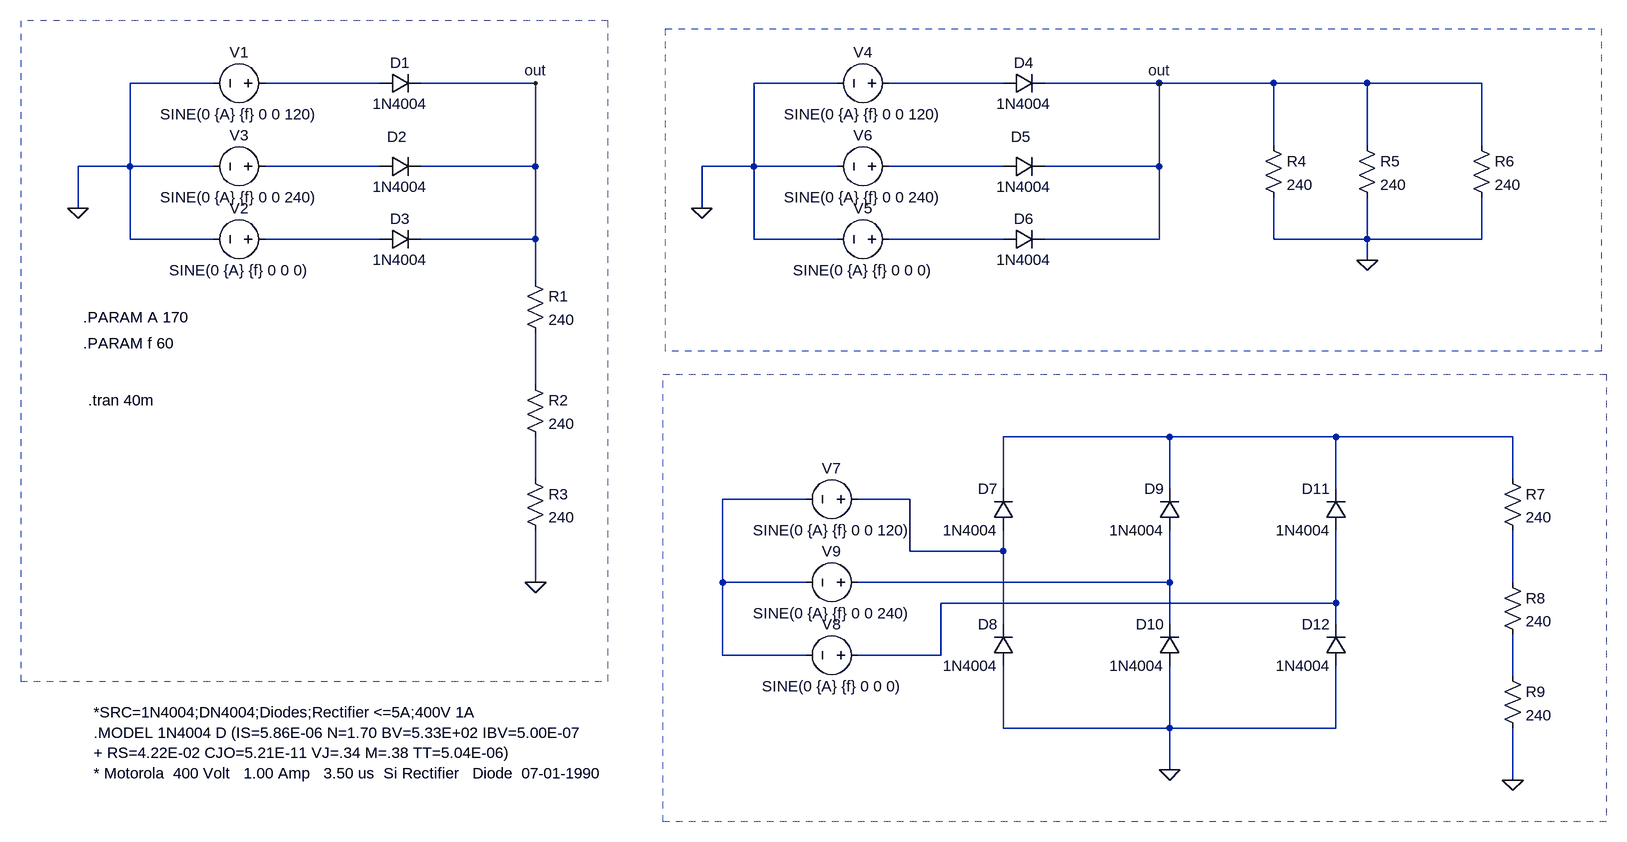
[diagram p0: schematic Draft1.asc]
Draft1.asc, the LTspice schematic file:
Version 4
SHEET 1 1908 1236
WIRE -240 96 -368 96
WIRE 16 96 -160 96
WIRE 256 96 80 96
WIRE 720 96 592 96
WIRE 976 96 800 96
WIRE 1216 96 1040 96
WIRE 1392 96 1216 96
WIRE 1536 96 1392 96
WIRE 1712 96 1536 96
WIRE 1392 192 1392 96
WIRE 1536 192 1536 96
WIRE 1712 192 1712 96
WIRE -368 224 -368 96
WIRE -368 224 -448 224
WIRE -240 224 -368 224
WIRE 16 224 -160 224
WIRE 256 224 256 96
WIRE 256 224 80 224
WIRE 592 224 592 96
WIRE 592 224 512 224
WIRE 720 224 592 224
WIRE 976 224 800 224
WIRE 1216 224 1216 96
WIRE 1216 224 1040 224
WIRE -448 288 -448 224
WIRE 512 288 512 224
WIRE -368 336 -368 224
WIRE -240 336 -368 336
WIRE 16 336 -160 336
WIRE 256 336 256 224
WIRE 256 336 80 336
WIRE 592 336 592 224
WIRE 720 336 592 336
WIRE 976 336 800 336
WIRE 1216 336 1216 224
WIRE 1216 336 1040 336
WIRE 1392 336 1392 272
WIRE 1536 336 1536 272
WIRE 1536 336 1392 336
WIRE 1712 336 1712 272
WIRE 1712 336 1536 336
WIRE 1536 368 1536 336
WIRE 256 400 256 336
WIRE 256 560 256 480
WIRE 1232 640 976 640
WIRE 1488 640 1232 640
WIRE 1760 640 1488 640
WIRE 256 704 256 640
WIRE 1760 704 1760 640
WIRE 976 720 976 640
WIRE 1232 720 1232 640
WIRE 1488 720 1488 640
WIRE 672 736 544 736
WIRE 832 736 752 736
WIRE 832 816 832 736
WIRE 976 816 976 784
WIRE 976 816 832 816
WIRE 256 864 256 784
WIRE 544 864 544 736
WIRE 672 864 544 864
WIRE 1232 864 1232 784
WIRE 1232 864 752 864
WIRE 1760 864 1760 784
WIRE 1488 896 1488 784
WIRE 1488 896 880 896
WIRE 976 928 976 816
WIRE 1232 928 1232 864
WIRE 1488 928 1488 896
WIRE 544 976 544 864
WIRE 672 976 544 976
WIRE 880 976 880 896
WIRE 880 976 752 976
WIRE 1760 1008 1760 944
WIRE 976 1088 976 992
WIRE 1232 1088 1232 992
WIRE 1232 1088 976 1088
WIRE 1488 1088 1488 992
WIRE 1488 1088 1232 1088
WIRE 1232 1152 1232 1088
WIRE 1760 1168 1760 1088
FLAG -448 288 0
FLAG 256 864 0
FLAG 256 96 out
FLAG 512 288 0
FLAG 1216 96 out
FLAG 1536 368 0
FLAG 1760 1168 0
FLAG 1232 1152 0
SYMBOL diode 16 112 R270
WINDOW 0 32 32 VTop 2
WINDOW 3 0 32 VBottom 2
SYMATTR InstName D1
SYMATTR Value 1N4004
SYMBOL diode 16 240 R270
WINDOW 0 46 27 VTop 2
WINDOW 3 0 32 VBottom 2
SYMATTR InstName D2
SYMATTR Value 1N4004
SYMBOL diode 16 352 R270
WINDOW 0 32 32 VTop 2
WINDOW 3 0 32 VBottom 2
SYMATTR InstName D3
SYMATTR Value 1N4004
SYMBOL Voltage -144 96 R90
WINDOW 0 -32 56 VBottom 2
WINDOW 3 32 56 VTop 2
SYMATTR InstName V1
SYMATTR Value SINE(0 {A} {f} 0 0 120)
SYMBOL Voltage -144 336 R90
WINDOW 0 -32 56 VBottom 2
WINDOW 3 32 56 VTop 2
SYMATTR InstName V2
SYMATTR Value SINE(0 {A} {f} 0 0 0)
SYMBOL Voltage -144 224 R90
WINDOW 0 -32 56 VBottom 2
WINDOW 3 32 56 VTop 2
SYMATTR InstName V3
SYMATTR Value SINE(0 {A} {f} 0 0 240)
SYMBOL Res 240 384 R0
SYMATTR InstName R1
SYMATTR Value 240
SYMBOL Res 240 544 R0
SYMATTR InstName R2
SYMATTR Value 240
SYMBOL Res 240 688 R0
SYMATTR InstName R3
SYMATTR Value 240
SYMBOL diode 976 112 R270
WINDOW 0 32 32 VTop 2
WINDOW 3 0 32 VBottom 2
SYMATTR InstName D4
SYMATTR Value 1N4004
SYMBOL diode 976 240 R270
WINDOW 0 46 27 VTop 2
WINDOW 3 0 32 VBottom 2
SYMATTR InstName D5
SYMATTR Value 1N4004
SYMBOL diode 976 352 R270
WINDOW 0 32 32 VTop 2
WINDOW 3 0 32 VBottom 2
SYMATTR InstName D6
SYMATTR Value 1N4004
SYMBOL Voltage 816 96 R90
WINDOW 0 -32 56 VBottom 2
WINDOW 3 32 56 VTop 2
SYMATTR InstName V4
SYMATTR Value SINE(0 {A} {f} 0 0 120)
SYMBOL Voltage 816 336 R90
WINDOW 0 -32 56 VBottom 2
WINDOW 3 32 56 VTop 2
SYMATTR InstName V5
SYMATTR Value SINE(0 {A} {f} 0 0 0)
SYMBOL Voltage 816 224 R90
WINDOW 0 -32 56 VBottom 2
WINDOW 3 32 56 VTop 2
SYMATTR InstName V6
SYMATTR Value SINE(0 {A} {f} 0 0 240)
SYMBOL Res 1376 176 R0
SYMATTR InstName R4
SYMATTR Value 240
SYMBOL Res 1520 176 R0
SYMATTR InstName R5
SYMATTR Value 240
SYMBOL Res 1696 176 R0
SYMATTR InstName R6
SYMATTR Value 240
SYMBOL Diode 992 784 R180
WINDOW 0 24 64 Left 2
WINDOW 3 24 0 Left 2
SYMATTR InstName D7
SYMATTR Value 1N4004
SYMBOL Diode 992 992 R180
WINDOW 0 24 64 Left 2
WINDOW 3 24 0 Left 2
SYMATTR InstName D8
SYMATTR Value 1N4004
SYMBOL Diode 1248 784 R180
WINDOW 0 24 64 Left 2
WINDOW 3 24 0 Left 2
SYMATTR InstName D9
SYMATTR Value 1N4004
SYMBOL Diode 1248 992 R180
WINDOW 0 24 64 Left 2
WINDOW 3 24 0 Left 2
SYMATTR InstName D10
SYMATTR Value 1N4004
SYMBOL Diode 1504 784 R180
WINDOW 0 24 64 Left 2
WINDOW 3 24 0 Left 2
SYMATTR InstName D11
SYMATTR Value 1N4004
SYMBOL Diode 1504 992 R180
WINDOW 0 24 64 Left 2
WINDOW 3 24 0 Left 2
SYMATTR InstName D12
SYMATTR Value 1N4004
SYMBOL Voltage 768 736 R90
WINDOW 0 -32 56 VBottom 2
WINDOW 3 32 56 VTop 2
SYMATTR InstName V7
SYMATTR Value SINE(0 {A} {f} 0 0 120)
SYMBOL Voltage 768 976 R90
WINDOW 0 -32 56 VBottom 2
WINDOW 3 32 56 VTop 2
SYMATTR InstName V8
SYMATTR Value SINE(0 {A} {f} 0 0 0)
SYMBOL Voltage 768 864 R90
WINDOW 0 -32 56 VBottom 2
WINDOW 3 32 56 VTop 2
SYMATTR InstName V9
SYMATTR Value SINE(0 {A} {f} 0 0 240)
SYMBOL Res 1744 688 R0
SYMATTR InstName R7
SYMATTR Value 240
SYMBOL Res 1744 848 R0
SYMATTR InstName R8
SYMATTR Value 240
SYMBOL Res 1744 992 R0
SYMATTR InstName R9
SYMATTR Value 240
TEXT -440 456 Left 2 !.PARAM A 170
TEXT -440 496 Left 2 !.PARAM f 60
TEXT -432 584 Left 2 !.tran 40m
TEXT -424 1064 Left 2 !*SRC=1N4004;DN4004;Diodes;Rectifier <=5A;400V 1A\n.MODEL 1N4004 D (IS=5.86E-06 N=1.70 BV=5.33E+02 IBV=5.00E-07\n+ RS=4.22E-02 CJO=5.21E-11 VJ=.34 M=.38 TT=5.04E-06)\n* Motorola  400 Volt   1.00 Amp   3.50 us  Si Rectifier   Diode  07-01-1990
RECTANGLE Normal 368 0 -536 1016 2
RECTANGLE Normal 452 544 1904 1232 2
RECTANGLE Normal 456 12 1896 508 2

The netlist it stands for:
* Draft1.asc
D1 N001 out 1N4004
D2 N003 out 1N4004
D3 N005 out 1N4004
V1 N001 0 SINE(0 {A} {f} 0 0 120)
V2 N005 0 SINE(0 {A} {f} 0 0 0)
V3 N003 0 SINE(0 {A} {f} 0 0 240)
R1 out N007 240
R2 N007 N009 240
R3 N009 0 240
D4 N002 out 1N4004
D5 N004 out 1N4004
D6 N006 out 1N4004
V4 N002 0 SINE(0 {A} {f} 0 0 120)
V5 N006 0 SINE(0 {A} {f} 0 0 0)
V6 N004 0 SINE(0 {A} {f} 0 0 240)
R4 out 0 240
R5 out 0 240
R6 out 0 240
D7 N011 N008 1N4004
D8 0 N011 1N4004
D9 N012 N008 1N4004
D10 0 N012 1N4004
D11 N014 N008 1N4004
D12 0 N014 1N4004
V7 N011 N010 SINE(0 {A} {f} 0 0 120)
V8 N014 N010 SINE(0 {A} {f} 0 0 0)
V9 N012 N010 SINE(0 {A} {f} 0 0 240)
R7 N008 N013 240
R8 N013 N015 240
R9 N015 0 240
.model D D
.lib standard.dio
.PARAM A 170
.PARAM f 60
.tran 40m
*SRC=1N4004;DN4004;Diodes;Rectifier <=5A;400V 1A
.MODEL 1N4004 D (IS=5.86E-06 N=1.70 BV=5.33E+02 IBV=5.00E-07
+ RS=4.22E-02 CJO=5.21E-11 VJ=.34 M=.38 TT=5.04E-06)
* Motorola  400 Volt   1.00 Amp   3.50 us  Si Rectifier   Diode  07-01-1990
.backanno
.end